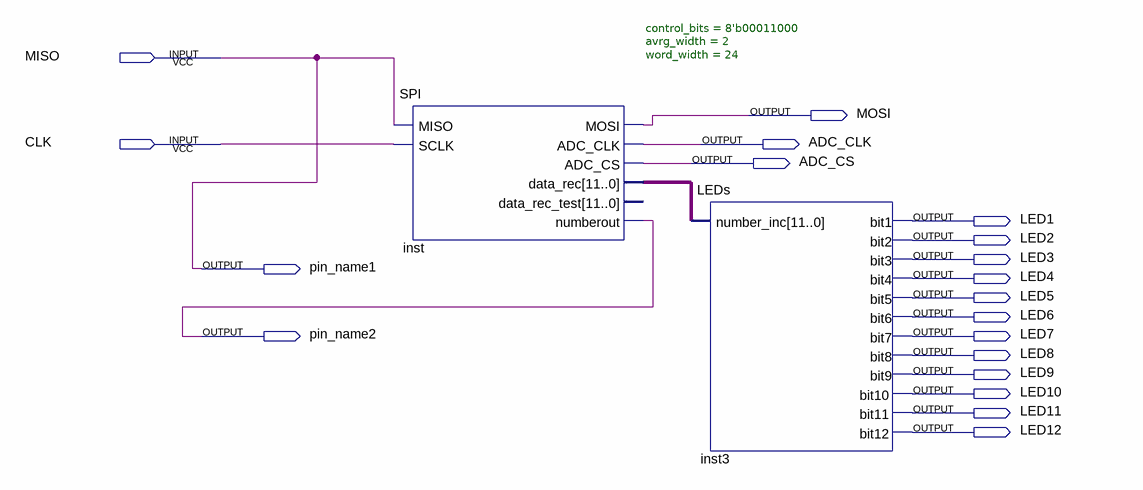
[diagram p0: schematic sheet]
// Quartus schematic old.bdf as structural Verilog: 2 symbols, 19 pins
module old (
  input  MISO,
  input  CLK,
  output MOSI,
  output ADC_CLK,
  output ADC_CS,
  output LED1,
  output LED2,
  output LED3,
  output pin_name1,
  output LED4,
  output LED5,
  output LED6,
  output pin_name2,
  output LED7,
  output LED8,
  output LED9,
  output LED10,
  output LED11,
  output LED12
);

  wire [11:0] inst_data_rec;

  SPI #(.control_bits(8'b00011000), .avrg_width(2), .word_width(24)) inst (
    .MISO(MISO), .SCLK(CLK), .MOSI(MOSI), .ADC_CLK(ADC_CLK), .ADC_CS(ADC_CS), .data_rec(inst_data_rec),
    .numberout(pin_name2));  // open: data_rec_test
  LEDs inst3 (
    .number_inc(inst_data_rec), .bit1(LED1), .bit2(LED2), .bit3(LED3), .bit4(LED4), .bit5(LED5), .bit6(LED6),
    .bit7(LED7), .bit8(LED8), .bit9(LED9), .bit10(LED10), .bit11(LED11), .bit12(LED12));

  assign pin_name1 = MISO;
endmodule
